# EAGLE design 4ROBOTS_UI_v_1_1 (EAGLE 9.5.0)
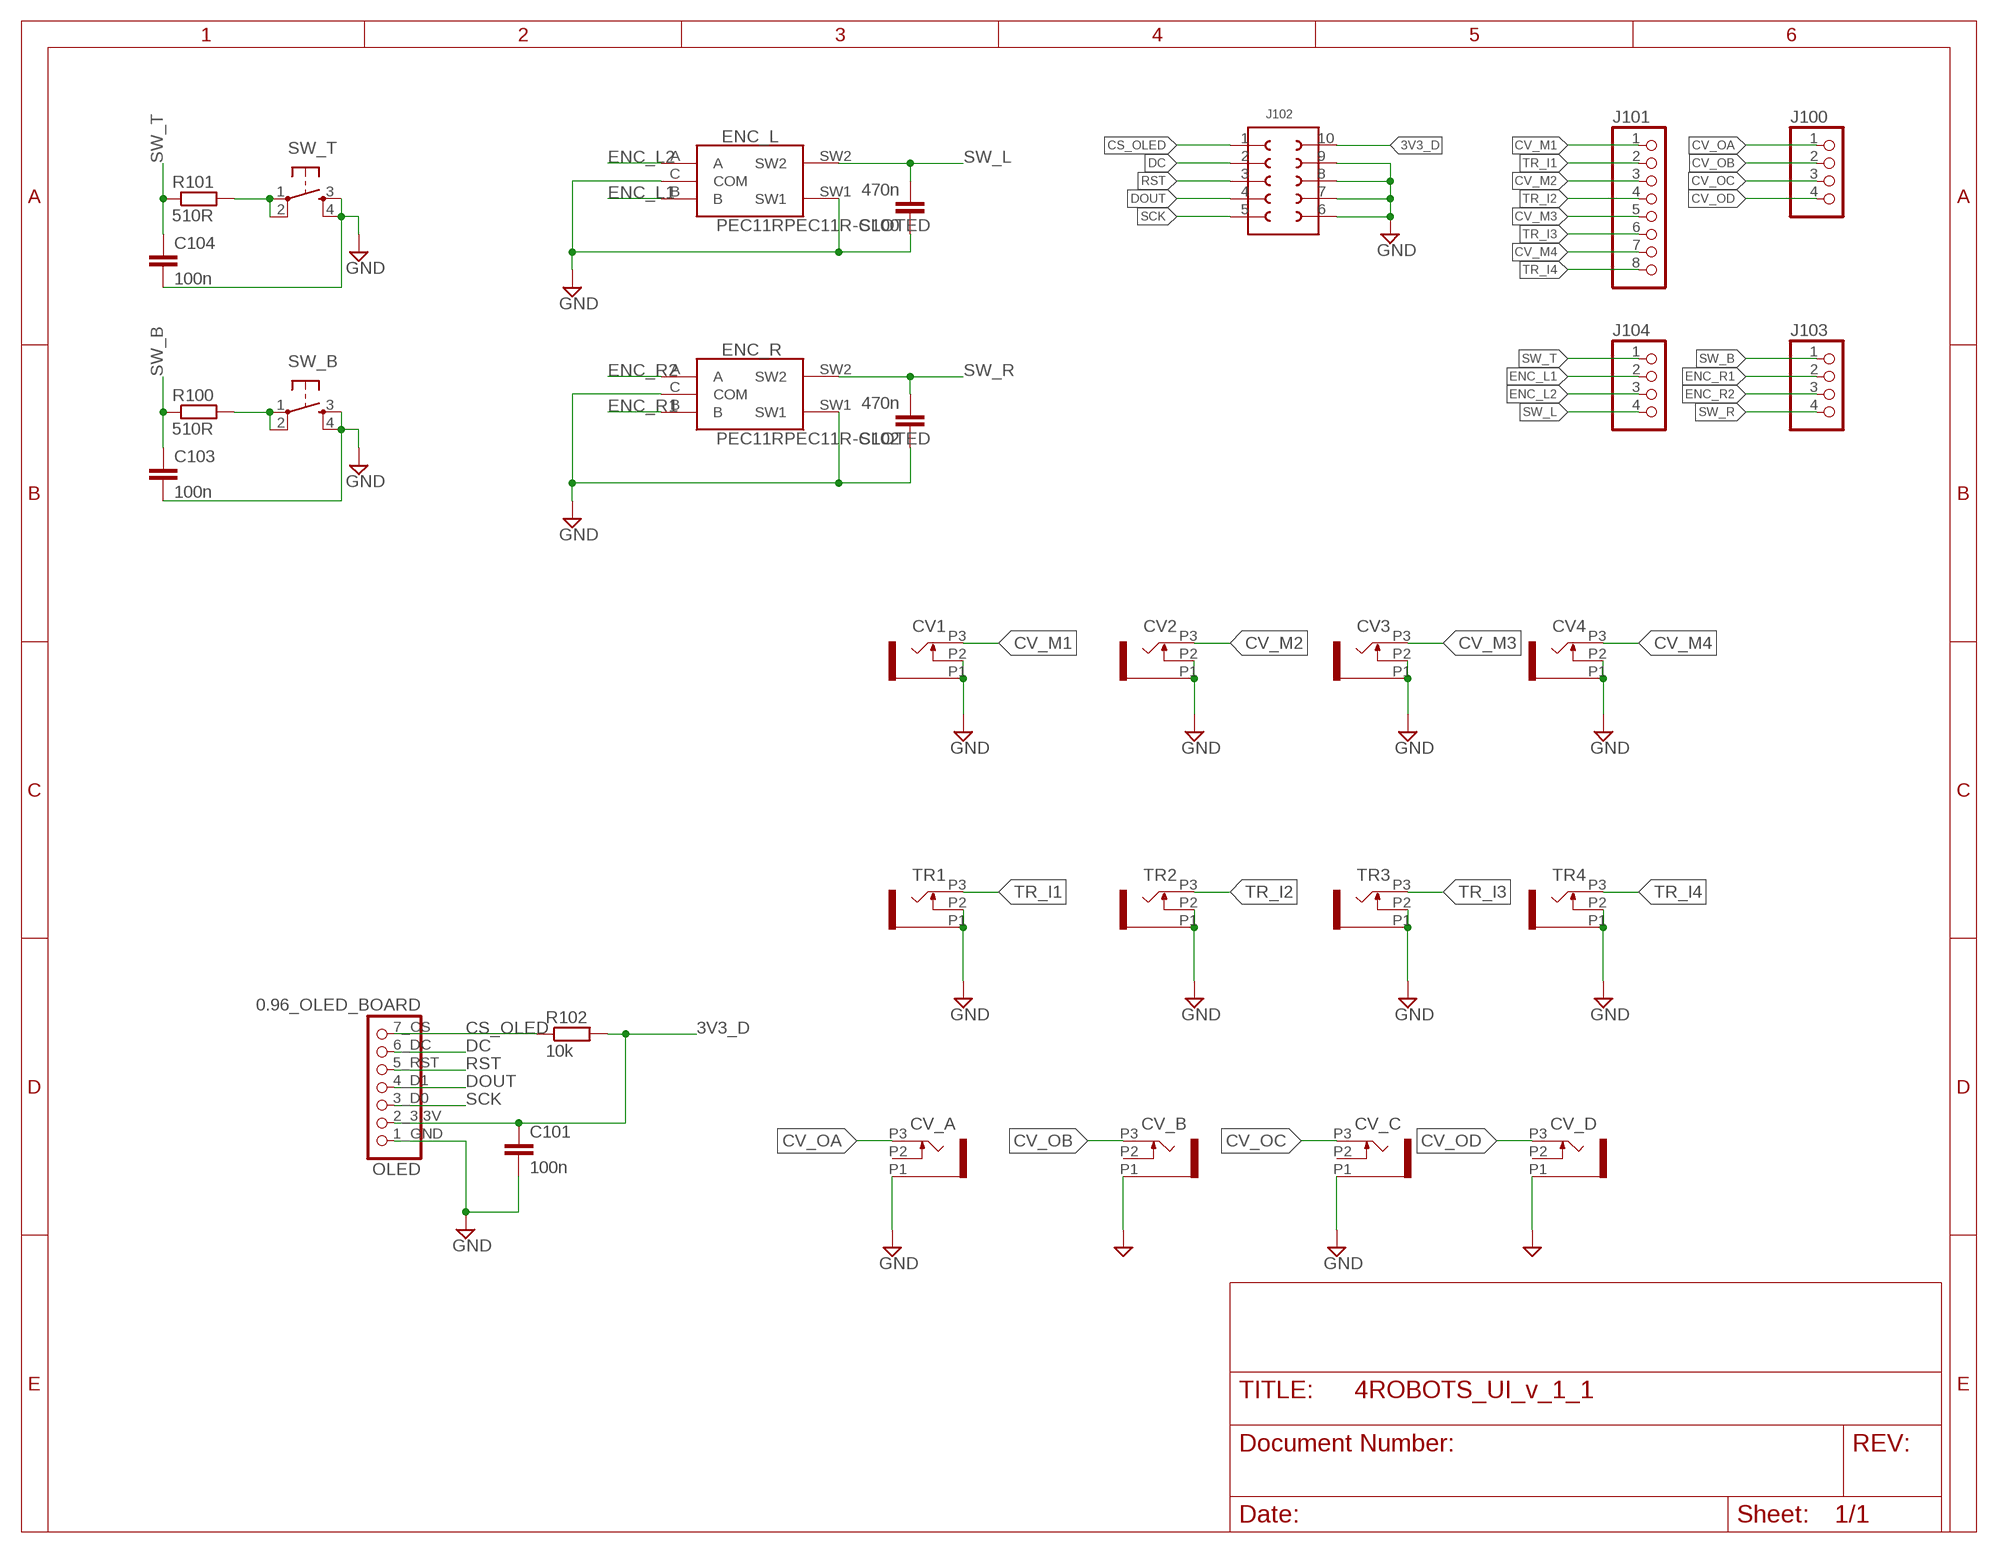
[diagram p0: schematic, sheet 1]

## Parts
C100  470n  C-EUC0603  [C0603]
C101  100n  C-EUC0603  [C0603]
C102  470n  C-EUC0603  [C0603]
C103  100n  C-EUC0603  [C0603]
C104  100n  C-EUC0603  [C0603]
CV1  OG-PJ301_PJ301_THONKICONN6  [OG-PJ301_WQP_PJ_301M6]
CV2  OG-PJ301_PJ301_THONKICONN6  [OG-PJ301_WQP_PJ_301M6]
CV3  OG-PJ301_PJ301_THONKICONN6  [OG-PJ301_WQP_PJ_301M6]
CV4  OG-PJ301_PJ301_THONKICONN6  [OG-PJ301_WQP_PJ_301M6]
CV_A  OG-PJ301_PJ301_THONKICONN6  [OG-PJ301_WQP_PJ_301M6]
CV_B  OG-PJ301_PJ301_THONKICONN6  [OG-PJ301_WQP_PJ_301M6]
CV_C  OG-PJ301_PJ301_THONKICONN6  [OG-PJ301_WQP_PJ_301M6]
CV_D  OG-PJ301_PJ301_THONKICONN6  [OG-PJ301_WQP_PJ_301M6]
ENC_L  PEC11RPEC11R-SLOTED  [PEC11R-SLOTED]
ENC_R  PEC11RPEC11R-SLOTED  [PEC11R-SLOTED]
J100  PINHD-1X4  [1X04]
J101  PINHD-1X8  [1X08]
J102  61301021121  [61301021121]
J103  PINHD-1X4  [1X04]
J104  PINHD-1X4  [1X04]
OLED  0.96_OLED_BOARD  [0.96_OLED_BOARD]
R100  510R  R-EU_R0603  [R0603]
R101  510R  R-EU_R0603  [R0603]
R102  10k  R-EU_R0603  [R0603]
SW_B  TAC_SWITCHPTH  [TACTILE-PTH]
SW_T  TAC_SWITCHPTH  [TACTILE-PTH]
TR1  OG-PJ301_PJ301_THONKICONN6  [OG-PJ301_WQP_PJ_301M6]
TR2  OG-PJ301_PJ301_THONKICONN6  [OG-PJ301_WQP_PJ_301M6]
TR3  OG-PJ301_PJ301_THONKICONN6  [OG-PJ301_WQP_PJ_301M6]
TR4  OG-PJ301_PJ301_THONKICONN6  [OG-PJ301_WQP_PJ_301M6]

## Nets
3V3_D: C101.1 J102.10 OLED.2_3.3V(3V3) R102.2
CS_OLED: J102.1 OLED.7_CS(CS) R102.1
CV_M1: CV1.P3 J101.1
CV_M2: CV2.P3 J101.3
CV_M3: CV3.P3 J101.5
CV_M4: CV4.P3 J101.7
CV_OA: CV_A.P3 J100.1
CV_OB: CV_B.P3 J100.2
CV_OC: CV_C.P3 J100.3
CV_OD: CV_D.P3 J100.4
DC: J102.2 OLED.6_DC(DC)
DOUT: J102.4 OLED.4_D1(D1)
ENC_L1: ENC_L.B J104.2
ENC_L2: ENC_L.A J104.3
ENC_R1: ENC_R.B J103.2
ENC_R2: ENC_R.A J103.3
GND: C100.1 C101.2 C102.1 C103.2 C104.2 CV1.P1 CV1.P2 CV2.P1 CV2.P2 CV3.P1 CV3.P2 CV4.P1 CV4.P2 CV_A.P1 CV_B.P1 CV_C.P1 CV_D.P1 ENC_L.C(COM) ENC_L.SW1 ENC_R.C(COM) ENC_R.SW1 J102.6 J102.7 J102.8 J102.9 OLED.1_GND(GND) SW_B.3 SW_B.4 SW_T.3 SW_T.4 TR1.P1 TR1.P2 TR2.P1 TR2.P2 TR3.P1 TR3.P2 TR4.P1 TR4.P2
N$7: R101.2 SW_T.1 SW_T.2
N$9: R100.2 SW_B.1 SW_B.2
RST: J102.3 OLED.5_RST(RST)
SCK: J102.5 OLED.3_D0(D0)
SW_B: C103.1 J103.1 R100.1
SW_L: C100.2 ENC_L.SW2 J104.4
SW_R: C102.2 ENC_R.SW2 J103.4
SW_T: C104.1 J104.1 R101.1
TR_I1: J101.2 TR1.P3
TR_I2: J101.4 TR2.P3
TR_I3: J101.6 TR3.P3
TR_I4: J101.8 TR4.P3
Unconnected: CV_A.P2 CV_B.P2 CV_C.P2 CV_D.P2

## Library data of the parts
C100-C104 = resistor:C-EU: CAPACITOR, European symbol
CV1-CV4 CV_A CV_B CV_C CV_D TR1-TR4 = SHAY_THONKICONNS:OG-PJ301_PJ301_THONKICONN
ENC_L ENC_R = PEC11R-4215K-S0024:PEC11R: Incremental encoder 24 detents 24 pulses Bourns 24 Pulse Incremental Mechanical Rotary Encoder with a 6 mm Flat Shaft (Not Indexed), Through Hole Source: Datasheet <http://uk.rs-online.com/web/p/products/7377742>
J100 J103 J104 = pinhead:PINHD-1X4: PIN HEADER
J101 = pinhead:PINHD-1X8: PIN HEADER
J102 = Wurth_Elektronik_Electromechanic_Board_to_Board_Connectors_rev17a:61301021121: WR-PHD 2.54mm Dual Pin Header, 10 Pins =>Code : Con_BTB_PHD_2.54_2_61301021121 <http://katalog.we-online.de/media/images/eican/Con_BTB_PHD_2.54_2_6130xx21121_pf2.jpg> Details see: http://katalog.we-online.de/en/em/613_0xx_211_21 Created 2014-05-29, Karrer Zheng 2014 (C) Würth Elektronik
OLED = 0_96_OLED_FOR_1U:0.96_OLED_BOARD
R100-R102 = rcl:R-EU_: RESISTOR, European symbol; SPICEPREFIX: R
SW_B SW_T = SparkFun:TAC_SWITCH: Momentary Switch Button commonly used for reset or general input. Spark Fun Electronics SKU : COM-00097

## Board
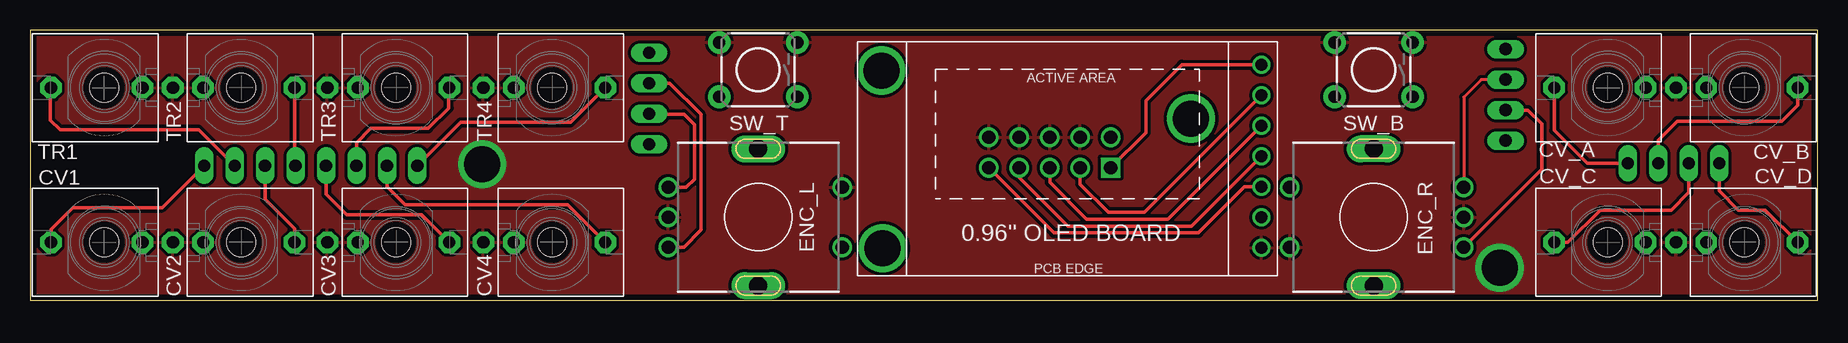
[diagram p1: board, top side]
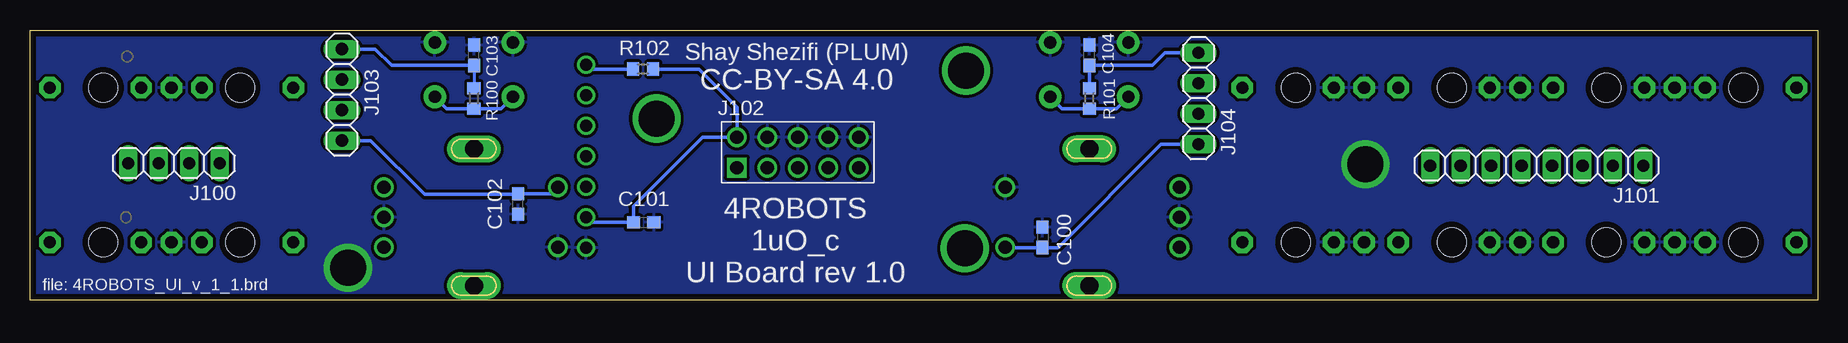
[diagram p2: board, bottom side, seen from below]

Size 149 x 22.5 mm. Coordinates in mm from the lower left corner, seen from the top.
Outline: 0,0 149,0 149,22.5 0,22.5 0,0
Copper layers (1*16): Top 0.035mm / dielectric 1.5mm / Bottom 0.035mm
Design rules "default *": minimum track width 6mil, minimum drill 0.4mm, track to track 10mil, track to pad 10mil, pad to pad 10mil, via to via 10mil, smd to smd 7mil, copper to edge 20mil, drill to drill 8mil, minimum pad ring 10mil, minimum via ring 8mil, stop-mask expansion 10mil, vias tented up to drill 25mil, thermal gap 10mil

### Footprints (pad centres in the part's own frame; a part is rotated, then mirrored left to right if it is on the bottom)
C0603 = smd 1.1 x 1: 1 -0.85,0; 2 0.85,0
OG-PJ301_WQP_PJ_301M6 = drill 1.016 pad 1.778 octagon: P1 0,-5.715; P2 0,-3.175; P3 0,4.445 | hole 2.4: 0,0
PEC11R-SLOTED = drill 1.1 pad 1.65: A -2.5,-7.5; B 2.5,-7.5; C 0,-7.5; SW1 -2.5,7; SW2 2.5,7 | drill 1.5 long: SH1 -5.7,0; SH2 5.7,0
1X04 = drill 1.016 long: 1 -3.81,0; 2 -1.27,0; 3 1.27,0; 4 3.81,0
1X08 = drill 1.016 long: 1 -8.89,0; 2 -6.35,0; 3 -3.81,0; 4 -1.27,0; 5 1.27,0; 6 3.81,0; 7 6.35,0; 8 8.89,0
61301021121 = drill 1.1 square: 1 -5.08,-1.27 | drill 1.1: 2 -2.54,-1.27; 3 0,-1.27; 4 2.54,-1.27; 5 5.08,-1.27; 6 5.08,1.27; 7 2.54,1.27; 8 0,1.27; 9 -2.54,1.27; 10 -5.08,1.27
0.96_OLED_BOARD = drill 1: 1_GND 33.666,2.345; 2_3.3V 33.666,4.885; 3_D0 33.666,7.425; 4_D1 33.666,9.965; 5_RST 33.666,12.505; 6_DC 33.666,15.045; 7_CS 33.666,17.585 | drill 3: MH1 2,17.1; MH2 2.1,2.3; MH3 27.8,13.1
R0603 = smd 1 x 1.1: 1 -0.85,0; 2 0.85,0
TACTILE-PTH = drill 1.016 pad 1.88: 1 -3.251,2.261; 2 3.251,2.261; 3 -3.251,-2.261; 4 3.251,-2.261

### Placement (x,y rotation side)
C100  64.59,5.22 270 bottom
C101  97.84,6.48 0 bottom
C102  108.3,8 90 bottom
C103  112,20.4 90 bottom
C104  60.7,20.4 90 bottom
CV1  6.2,4.8 90 top
CV2  17.6,4.8 270 top
CV3  30.5,4.8 270 top
CV4  43.5,4.8 270 top
CV_A  131.5,17.7 90 top
CV_B  142.9,17.7 270 top
CV_C  131.5,4.8 90 top
CV_D  142.9,4.8 270 top
ENC_L  60.7,6.9 270 top
ENC_R  112,6.9 90 top
J100  137,11.4 180 bottom
J101  23.4,11.2 180 bottom
J102  85,12.3 0 bottom
J103  123,17.1 270 bottom
J104  51.6,16.8 270 bottom
OLED  68.98,2.02 0 top
R100  112,16.8 270 bottom
R101  60.7,16.8 270 bottom
R102  97.9,19.25 0 bottom
SW_B  112,19.2 180 top
SW_T  60.7,19.2 180 top
TR1  6.2,17.7 90 top
TR2  17.6,17.7 270 top
TR3  30.5,17.7 270 top
TR4  43.5,17.7 270 top

### Tracks (layer width: path | path; a pad name or v marks a point on that pad's centre or on a via)
3V3_D
  Bottom 0.305: R102.2 93.25,19.25 90.08,16.08 J102.10 92.93,13.57 98.69,7.81 C101.1 102.22,6.48 OLED.2_3.3V
CS_OLED
  Top 0.305: J102.1 93,13.95 93,16.6 96,19.61 OLED.7_CS
  Bottom 0.305: OLED.7_CS 102.29,19.25 R102.1
CV_M1
  Top 0.305: J101.1 11.01,7.7 3.55,7.7 1.75,5.9 CV1.P3
CV_M2
  Top 0.305: J101.3 19.59,8.41 22.05,5.96 CV2.P3
CV_M3
  Top 0.305: CV3.P3 32.65,7.1 26.4,7.1 24.7,8.8 24.7,11.17 J101.5
CV_M4
  Top 0.305: J101.7 29.75,9.45 31.25,7.95 44.8,7.95 CV4.P3
CV_OA
  Top 0.305: CV_A.P3 127.06,14.14 129.8,11.4 J100.1
CV_OB
  Top 0.305: J100.2 135.73,13.33 137.3,14.9 146,14.9 147.34,16.25 CV_B.P3
CV_OC
  Top 0.305: CV_C.P3 128.2,4.8 130.9,7.5 136.8,7.5 138.27,8.97 J100.3
CV_OD
  Top 0.305: CV_D.P3 144.65,7.5 142.4,7.5 140.81,9.09 J100.4
DC
  Top 0.305: J102.2 87.54,9.66 89.9,7.3 92.88,7.3 OLED.6_DC
DOUT
  Top 0.305: OLED.4_D1 96.82,6.16 86.5,6.16 82.46,10.2 J102.4
ENC_L1
  Top 0.305: ENC_L.B 54.5,4.4 55.94,5.83 55.94,15.46 53.33,18.07 J104.2
ENC_L2
  Top 0.305: J104.3 51.63,15.5 54.5,15.5 55.38,14.62 55.38,10.08 54.7,9.4 ENC_L.A
ENC_R1
  Top 0.254: J103.2 120.97,18.37 119.5,16.9 ENC_R.B
ENC_R2
  Top 0.305: J103.3 124.87,15.83 126,14.7 126,10.9 ENC_R.A
GND  (via drill 3)
  other vias: 37.7,11.3 122.5,2.7
  pour Top (rank 3): 0,22.5 149,22.5 149,0 0,0
  pour Bottom (rank 3): 0,22.5 149,22.5 149,0 0,0
N$7
  Bottom 0.305: SW_T.1 62.96,15.95 R101.2 58.44,15.95 SW_T.2
N$9
  Bottom 0.305: SW_B.1 114.26,15.95 R100.2 109.74,15.95 SW_B.2
RST
  Top 0.305: OLED.5_RST 94.84,6.72 88.08,6.72 85,9.8 J102.3
SCK
  Top 0.305: J102.5 85.35,5.6 97.4,5.6 101.25,9.45 OLED.3_D0
SW_B
  Bottom 0.254: C103.1 R100.1
  Bottom 0.305: J103.1 120.21,20.91 118.85,19.55 C103.1
SW_L
  Bottom 0.305: J104.4 54.71,12.99 63.33,4.37 C100.2 67.67,4.37 ENC_L.SW2
SW_R
  Bottom 0.254: 108.35,8.8 C102.2
  Bottom 0.305: J103.4 120.59,13.29 116.1,8.8 108.35,8.8 | C102.2 105.55,8.85 ENC_R.SW2
SW_T
  Bottom 0.305: J104.1 54.39,20.61 55.45,19.55 C104.1 R101.1
TR_I1
  Top 0.305: J101.2 14.05,14.2 2.5,14.2 1.7,15 1.7,17.64 TR1.P3
TR_I2
  Top 0.305: J101.4 22.05,11.29 TR2.P3
TR_I3
  Top 0.305: J101.6 27.21,13.11 28.4,14.3 33.2,14.3 34.9,16 34.9,17.66 TR3.P3
TR_I4
  Top 0.305: J101.8 35.89,14.8 45.05,14.8 TR4.P3

### Text on the board
bPlace: Shay Shezifi (PLUM) | CC-BY-SA 4.0 | 4ROBOTS / 1uO_c / UI Board rev 1.0 | file: 4ROBOTS_UI_v_1_1.brd